# EAGLE design MA163 (EAGLE 9.6.2)

## Sheet 1 of 3
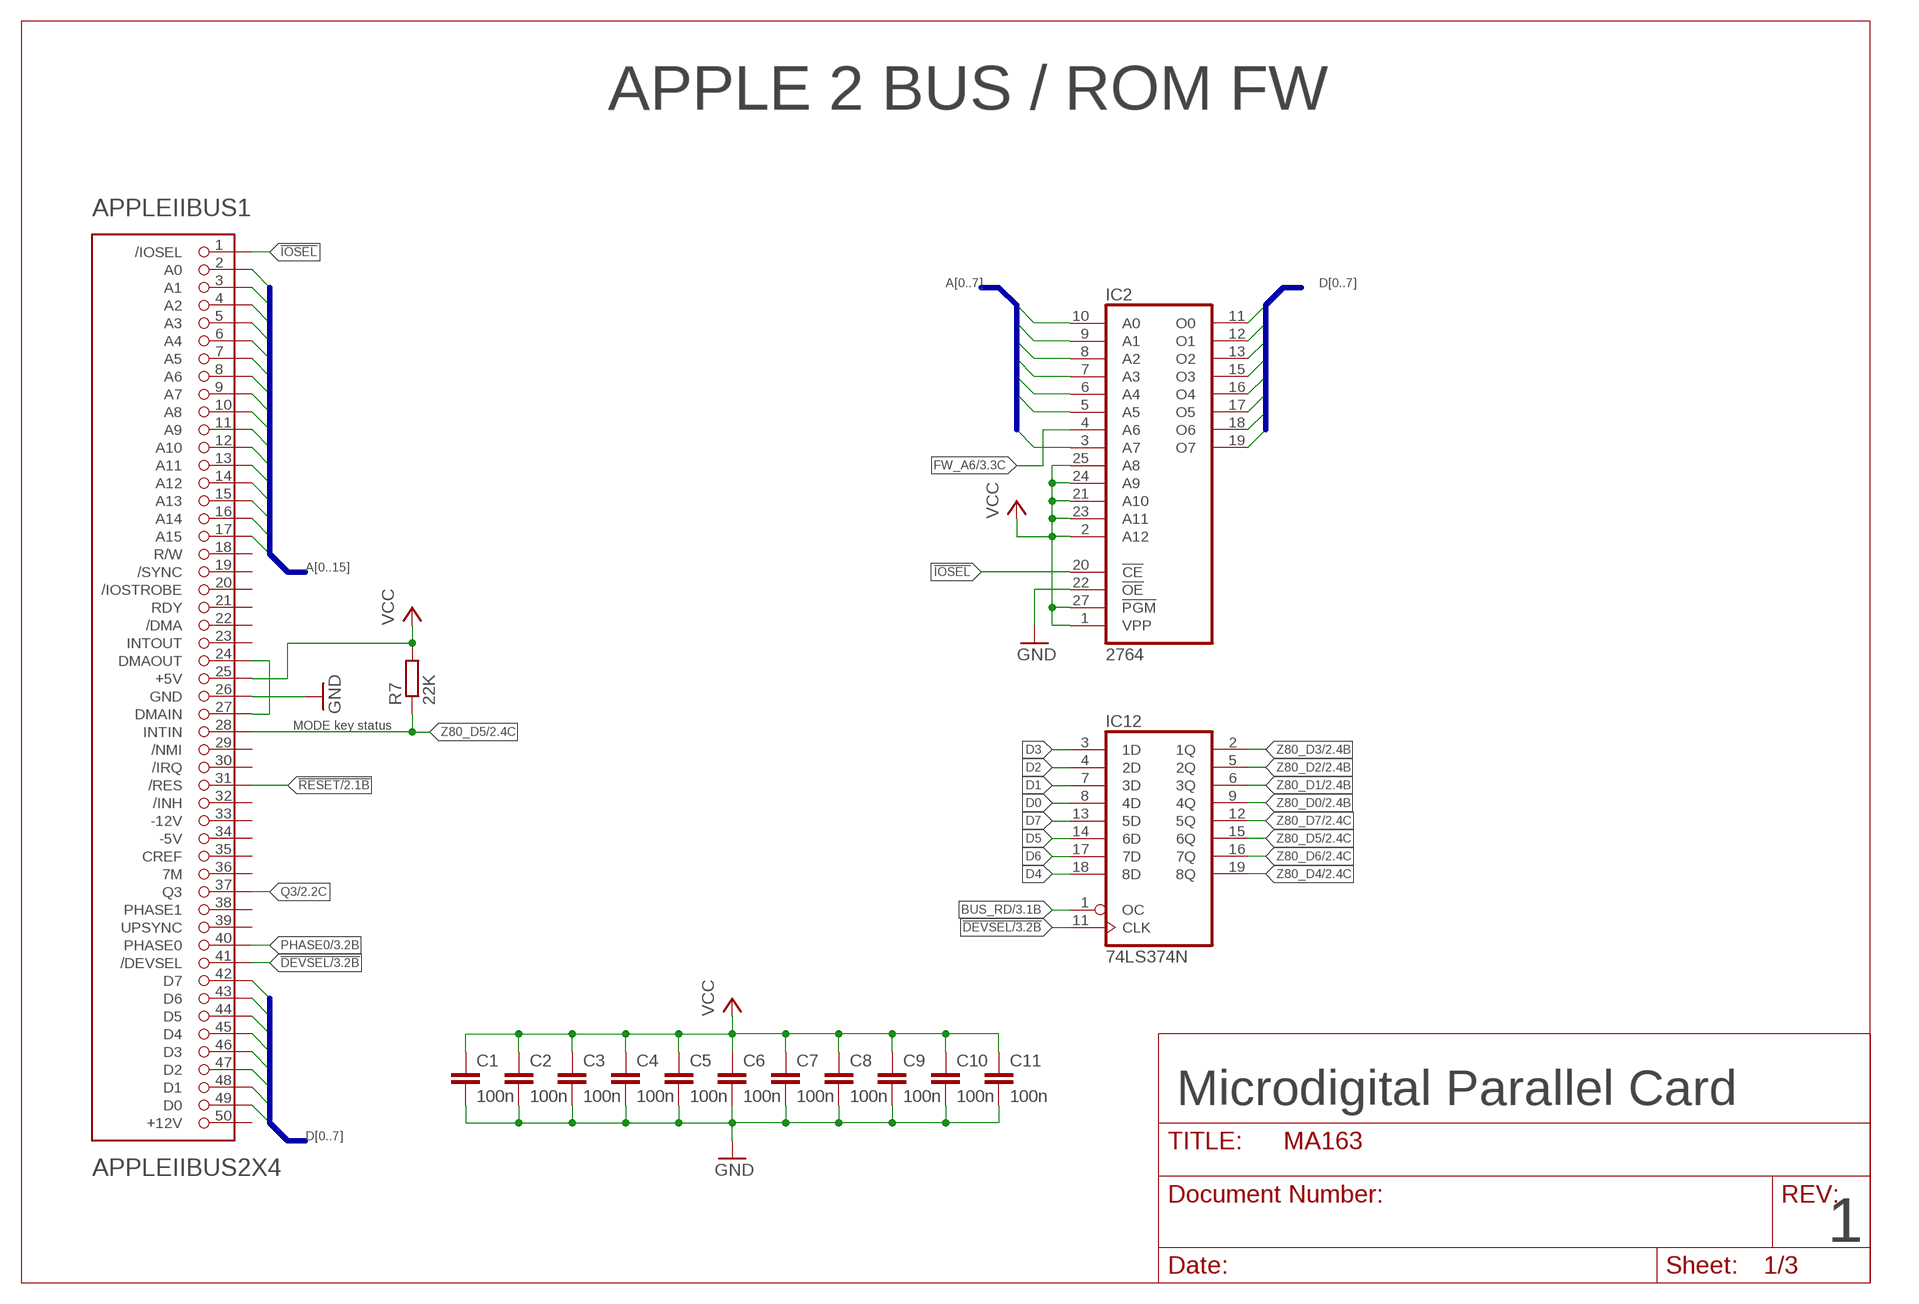
[diagram p0: schematic, sheet 1]

### Parts
APPLEIIBUS1  APPLEIIBUS2X4  [SLOT]
C1  100n  C-EU050-025X075  [C050-025X075]
C2  100n  C-EU050-025X075  [C050-025X075]
C3  100n  C-EU050-025X075  [C050-025X075]
C4  100n  C-EU050-025X075  [C050-025X075]
C5  100n  C-EU050-025X075  [C050-025X075]
C6  100n  C-EU050-025X075  [C050-025X075]
C7  100n  C-EU050-025X075  [C050-025X075]
C8  100n  C-EU050-025X075  [C050-025X075]
C9  100n  C-EU050-025X075  [C050-025X075]
C10  100n  C-EU050-025X075  [C050-025X075]
C11  100n  C-EU050-025X075  [C050-025X075]
IC2  2764  [DIL28]
IC12  74LS374N  [DIL20]
R7  22K  R-EU_0207/12  [0207/12]

### Nets
!DEVSEL: APPLEIIBUS1.41(/DEVSEL) IC12.11(CLK) ; also sheet 3
!IOSEL: APPLEIIBUS1.1(/IOSEL) IC2.20(!CE)
!RESET: APPLEIIBUS1.31(/RES) ; also sheet 2,3
A0: APPLEIIBUS1.2(A0) IC2.10(A0)
A1: APPLEIIBUS1.3(A1) IC2.9(A1)
A2: APPLEIIBUS1.4(A2) IC2.8(A2)
A3: APPLEIIBUS1.5(A3) IC2.7(A3)
A4: APPLEIIBUS1.6(A4) IC2.6(A4)
A5: APPLEIIBUS1.7(A5) IC2.5(A5)
A6: APPLEIIBUS1.8(A6) ; also sheet 3
A7: APPLEIIBUS1.9(A7) IC2.3(A7) ; also sheet 3
A8: APPLEIIBUS1.10(A8)
A9: APPLEIIBUS1.11(A9)
A10: APPLEIIBUS1.12(A10)
A11: APPLEIIBUS1.13(A11)
A12: APPLEIIBUS1.14(A12)
A13: APPLEIIBUS1.15(A13)
A14: APPLEIIBUS1.16(A14)
A15: APPLEIIBUS1.17(A15)
BUS_RD: IC12.1(OC) ; also sheet 3
D0: APPLEIIBUS1.49(D0) IC2.11(O0) IC12.8(4D)
D1: APPLEIIBUS1.48(D1) IC2.12(O1) IC12.7(3D)
D2: APPLEIIBUS1.47(D2) IC2.13(O2) IC12.4(2D)
D3: APPLEIIBUS1.46(D3) IC2.15(O3) IC12.3(1D)
D4: APPLEIIBUS1.45(D4) IC2.16(O4) IC12.18(8D)
D5: APPLEIIBUS1.44(D5) IC2.17(O5) IC12.14(6D)
D6: APPLEIIBUS1.43(D6) IC2.18(O6) IC12.17(7D)
D7: APPLEIIBUS1.42(D7) IC2.19(O7) IC12.13(5D)
FW_A6: IC2.4(A6) ; also sheet 3
GND [Power]: APPLEIIBUS1.26(GND) C1.2 C2.2 C3.2 C4.2 C5.2 C6.2 C7.2 C8.2 C9.2 C10.2 C11.2 IC2.22(!OE) ; also sheet 2,3
N$14: APPLEIIBUS1.24(DMAOUT) APPLEIIBUS1.27(DMAIN)
PHASE0: APPLEIIBUS1.40(PHASE0) ; also sheet 3
Q3: APPLEIIBUS1.37(Q3) ; also sheet 2
VCC [Power]: APPLEIIBUS1.25(+5V) C1.1 C2.1 C3.1 C4.1 C5.1 C6.1 C7.1 C8.1 C9.1 C10.1 C11.1 IC2.1(VPP) IC2.2(A12) IC2.21(A10) IC2.23(A11) IC2.24(A9) IC2.25(A8) IC2.27(!PGM) R7.2 ; also sheet 2,3
Z80_D0: IC12.9(4Q) ; also sheet 2,3
Z80_D1: IC12.6(3Q) ; also sheet 2,3
Z80_D2: IC12.5(2Q) ; also sheet 2,3
Z80_D3: IC12.2(1Q) ; also sheet 2,3
Z80_D4: IC12.19(8Q) ; also sheet 2,3
Z80_D5: APPLEIIBUS1.28(INTIN) IC12.15(6Q) R7.1 ; also sheet 2,3
Z80_D6: IC12.16(7Q) ; also sheet 2,3
Z80_D7: IC12.12(5Q) ; also sheet 2,3
Unconnected: APPLEIIBUS1.18(R/W) APPLEIIBUS1.19(/SYNC) APPLEIIBUS1.20(/IOSTROBE) APPLEIIBUS1.21(RDY) APPLEIIBUS1.22(/DMA) APPLEIIBUS1.23(INTOUT) APPLEIIBUS1.29(/NMI) APPLEIIBUS1.30(/IRQ) APPLEIIBUS1.32(/INH) APPLEIIBUS1.33(-12V) APPLEIIBUS1.34(-5V) APPLEIIBUS1.35(CREF) APPLEIIBUS1.36(7M) APPLEIIBUS1.38(PHASE1) APPLEIIBUS1.39(UPSYNC) APPLEIIBUS1.50(+12V)

### Buses
D[0..7]
A[0..15]
A[0..7]

### Notes on the sheet
- APPLE 2 BUS / ROM FW
- MODE key status
- Microdigital Parallel Card
- 1

## Sheet 2 of 3
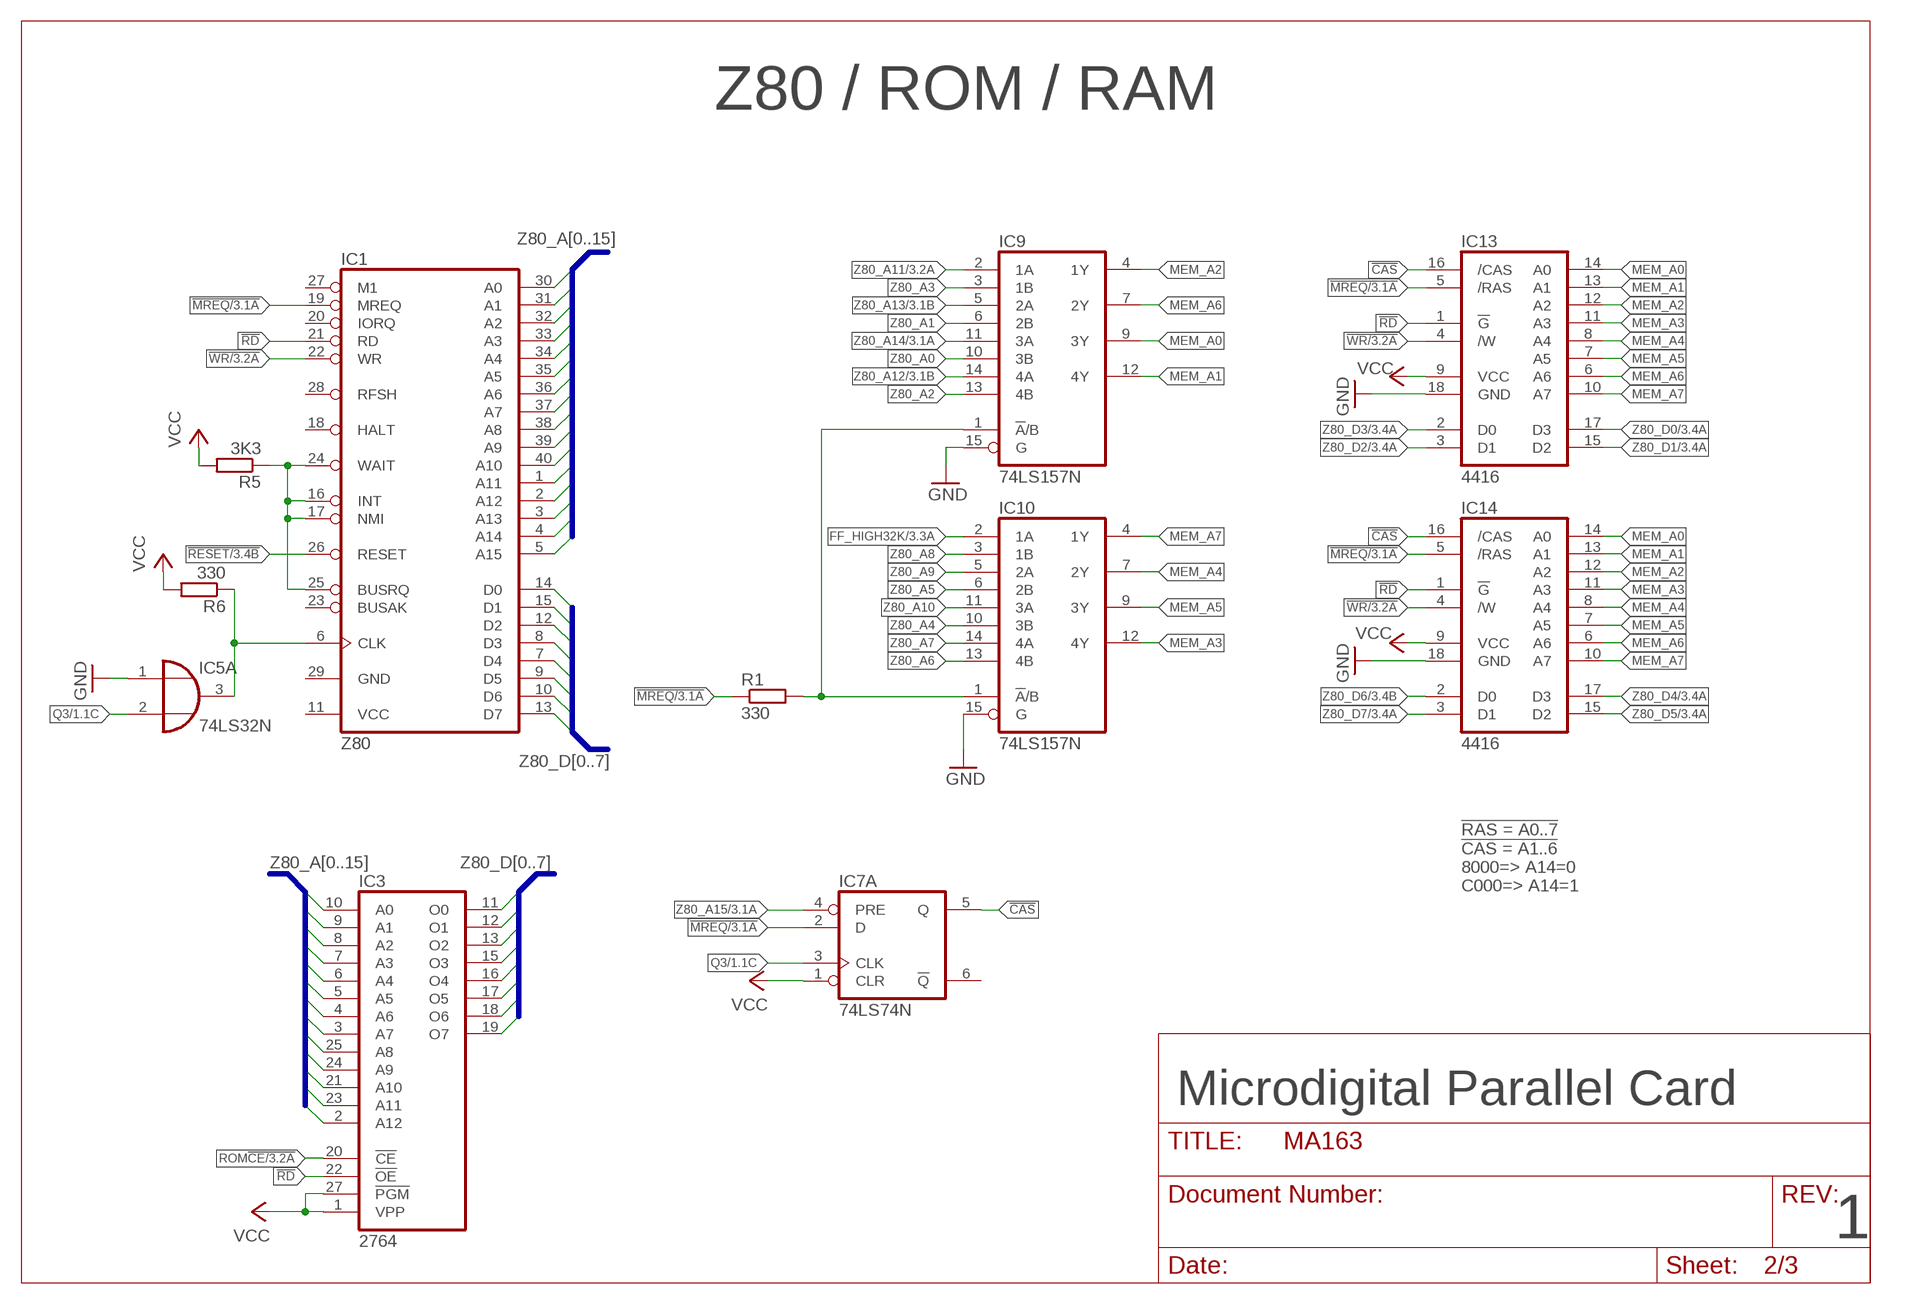
[diagram p1: schematic, sheet 2]

### Parts
IC1  Z80  Z80CPU  [DIL40]
IC3  2764  [DIL28]
IC5  74LS32N  [DIL14]
IC7  74LS74N  [DIL14]
IC9  74LS157N  [DIL16]
IC10  74LS157N  [DIL16]
IC13  4416  [DIL18]
IC14  4416  [DIL18]
R1  330  R-EU_0207/5V  [0207/5V]
R5  3K3  R-EU_0207/5V  [0207/5V]
R6  330  R-EU_0207/5V  [0207/5V]

### Nets
!CAS: IC7.5(A:Q) IC13.16(/CAS) IC14.16(/CAS)
!MREQ: IC1.19(MREQ) IC7.2(A:D) IC13.5(/RAS) IC14.5(/RAS) R1.1 ; also sheet 3
!RD: IC1.21(RD) IC3.22(!OE) IC13.1(!G) IC14.1(!G)
!RESET: IC1.26(RESET) ; also sheet 1,3
!WR: IC1.22(WR) IC13.4(/W) IC14.4(/W) ; also sheet 3
!Z80_CLK: IC1.6(CLK) IC5.3(A:O) R6.1
FF_HIGH32K: IC10.2(1A) ; also sheet 3
GND [Power]: IC5.1(A:I0) IC9.15(G) IC10.15(G) IC13.18(GND) IC14.18(GND) ; also sheet 1,3
MEM_A0: IC9.9(3Y) IC13.14(A0) IC14.14(A0)
MEM_A1: IC9.12(4Y) IC13.13(A1) IC14.13(A1)
MEM_A2: IC9.4(1Y) IC13.12(A2) IC14.12(A2)
MEM_A3: IC10.12(4Y) IC13.11(A3) IC14.11(A3)
MEM_A4: IC10.7(2Y) IC13.8(A4) IC14.8(A4)
MEM_A5: IC10.9(3Y) IC13.7(A5) IC14.7(A5)
MEM_A6: IC9.7(2Y) IC13.6(A6) IC14.6(A6)
MEM_A7: IC10.4(1Y) IC13.10(A7) IC14.10(A7)
N$1: IC1.16(INT) IC1.17(NMI) IC1.24(WAIT) IC1.25(BUSRQ) R5.1
N$4: IC9.1(!A!/B) IC10.1(!A!/B) R1.2
Q3: IC5.2(A:I1) IC7.3(A:CLK) ; also sheet 1
ROM!CE: IC3.20(!CE) ; also sheet 3
VCC [Power]: IC3.1(VPP) IC3.27(!PGM) IC7.1(A:CLR) IC13.9(VCC) IC14.9(VCC) R5.2 R6.2 ; also sheet 1,3
Z80_A0: IC1.30(A0) IC3.10(A0) IC9.10(3B)
Z80_A1: IC1.31(A1) IC3.9(A1) IC9.6(2B)
Z80_A2: IC1.32(A2) IC3.8(A2) IC9.13(4B)
Z80_A3: IC1.33(A3) IC3.7(A3) IC9.3(1B)
Z80_A4: IC1.34(A4) IC3.6(A4) IC10.10(3B)
Z80_A5: IC1.35(A5) IC3.5(A5) IC10.6(2B)
Z80_A6: IC1.36(A6) IC3.4(A6) IC10.13(4B)
Z80_A7: IC1.37(A7) IC3.3(A7) IC10.14(4A)
Z80_A8: IC1.38(A8) IC3.25(A8) IC10.3(1B)
Z80_A9: IC1.39(A9) IC3.24(A9) IC10.5(2A)
Z80_A10: IC1.40(A10) IC3.21(A10) IC10.11(3A)
Z80_A11: IC1.1(A11) IC3.23(A11) IC9.2(1A) ; also sheet 3
Z80_A12: IC1.2(A12) IC3.2(A12) IC9.14(4A) ; also sheet 3
Z80_A13: IC1.3(A13) IC9.5(2A) ; also sheet 3
Z80_A14: IC1.4(A14) IC9.11(3A) ; also sheet 3
Z80_A15: IC1.5(A15) IC7.4(A:PRE) ; also sheet 3
Z80_D0: IC1.14(D0) IC3.11(O0) IC13.17(D3) ; also sheet 1,3
Z80_D1: IC1.15(D1) IC3.12(O1) IC13.15(D2) ; also sheet 1,3
Z80_D2: IC1.12(D2) IC3.13(O2) IC13.3(D1) ; also sheet 1,3
Z80_D3: IC1.8(D3) IC3.15(O3) IC13.2(D0) ; also sheet 1,3
Z80_D4: IC1.7(D4) IC3.16(O4) IC14.17(D3) ; also sheet 1,3
Z80_D5: IC1.9(D5) IC3.17(O5) IC14.15(D2) ; also sheet 1,3
Z80_D6: IC1.10(D6) IC3.18(O6) IC14.2(D0) ; also sheet 1,3
Z80_D7: IC1.13(D7) IC3.19(O7) IC14.3(D1) ; also sheet 1,3
Unconnected: IC1.18(HALT) IC1.20(IORQ) IC1.23(BUSAK) IC1.27(M1) IC1.28(RFSH) IC7.6(A:!Q)

### Buses
Z80_D[0..7]
Z80_A[0..15]

### Notes on the sheet
- Z80 / ROM / RAM
- !RAS = A0..7
  !CAS = A1..6
  8000=> A14=0
  C000=> A14=1
- Microdigital Parallel Card
- 1

## Sheet 3 of 3
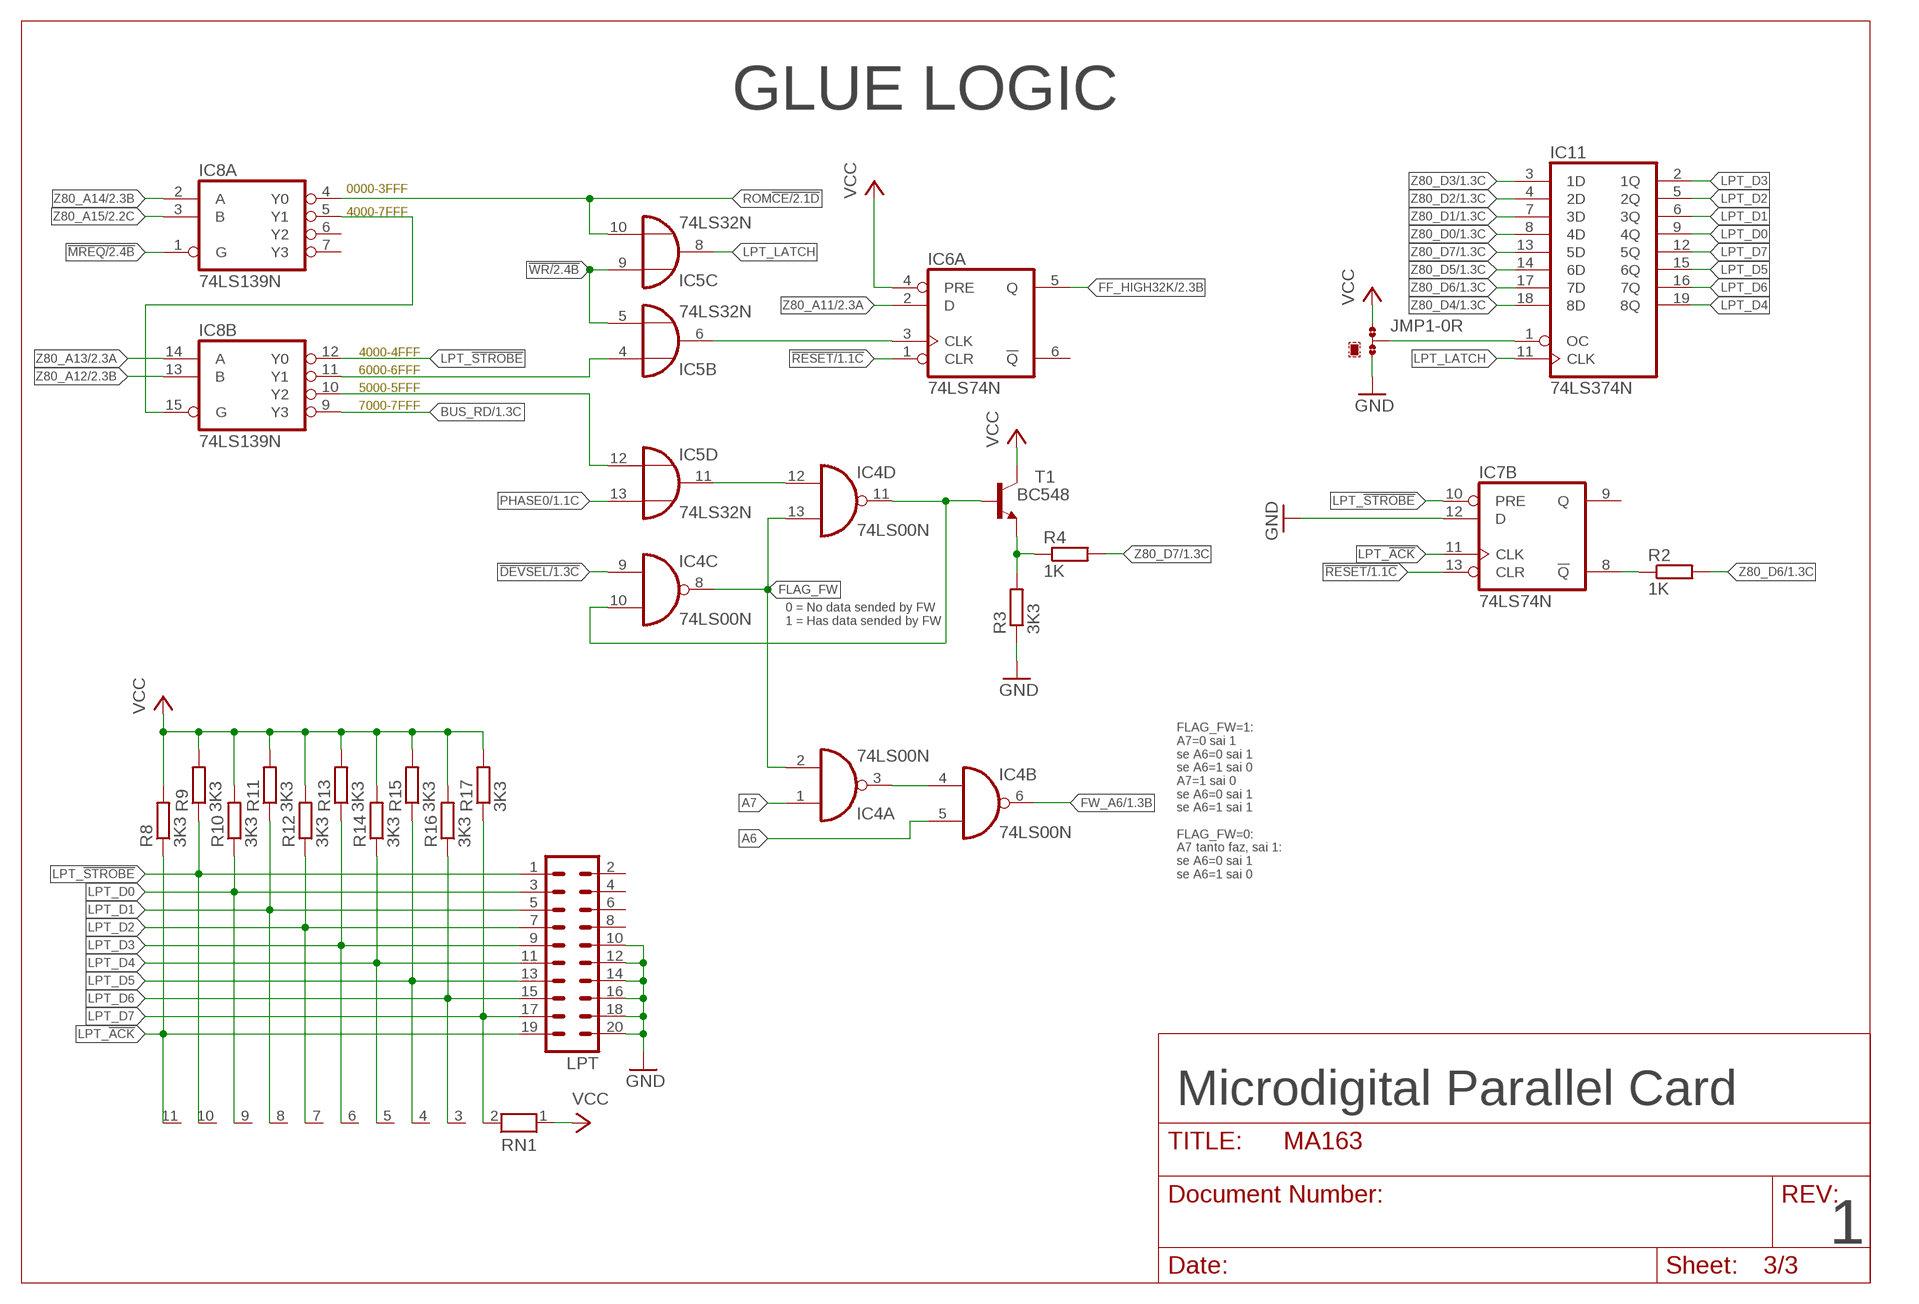
[diagram p2: schematic, sheet 3]

### Parts
IC4  74LS00N  [DIL14]
IC6  74LS74N  [DIL14]
IC8  74LS139N  [DIL16]
IC11  74LS374N  [DIL20]
JMP1  0R-JUMPB  [B0R-JMP]
LPT  MA10-2  [MA10-2]
R2  1K  R-EU_0207/5V  [0207/5V]
R3  3K3  R-EU_0207/5V  [0207/5V]
R4  1K  R-EU_0207/5V  [0207/5V]
R8  3K3  R-EU_0207/2V  [0207/2V]
R9  3K3  R-EU_0207/2V  [0207/2V]
R10  3K3  R-EU_0207/2V  [0207/2V]
R11  3K3  R-EU_0207/2V  [0207/2V]
R12  3K3  R-EU_0207/2V  [0207/2V]
R13  3K3  R-EU_0207/2V  [0207/2V]
R14  3K3  R-EU_0207/2V  [0207/2V]
R15  3K3  R-EU_0207/2V  [0207/2V]
R16  3K3  R-EU_0207/2V  [0207/2V]
R17  3K3  R-EU_0207/2V  [0207/2V]
RN1  RN10  [RN-11]
T1  BC548  -NPN-TO92L  [TO92L]

### Nets
!DEVSEL: IC4.9(C:I0) ; also sheet 1
!MREQ: IC8.1(A:G) ; also sheet 2
!RESET: IC6.1(A:CLR) IC7.13(B:CLR) ; also sheet 1,2
!WR: IC5.5(B:I1) IC5.9(C:I0) ; also sheet 2
A6: IC4.5(B:I1) ; also sheet 1
A7: IC4.1(A:I0) ; also sheet 1
BUS_RD: IC8.9(B:Y3) ; also sheet 1
FF_HIGH32K: IC6.5(A:Q) ; also sheet 2
FLAG_FW: IC4.2(A:I1) IC4.8(C:O) IC4.13(D:I1)
FW_A6: IC4.6(B:O) ; also sheet 1
GND [Power]: IC7.12(B:D) JMP1.3 LPT.10 LPT.12 LPT.14 LPT.16 LPT.18 LPT.20 R3.1 ; also sheet 1,2
LPT_!ACK: IC7.11(B:CLK) LPT.19 R8.1 RN1.11
LPT_!STROBE: IC7.10(B:PRE) IC8.12(B:Y0) LPT.1 R9.1 RN1.10
LPT_D0: IC11.9(4Q) LPT.3 R10.1 RN1.9
LPT_D1: IC11.6(3Q) LPT.5 R11.1 RN1.8
LPT_D2: IC11.5(2Q) LPT.7 R12.1 RN1.7
LPT_D3: IC11.2(1Q) LPT.9 R13.1 RN1.6
LPT_D4: IC11.19(8Q) LPT.11 R14.1 RN1.5
LPT_D5: IC11.15(6Q) LPT.13 R15.1 RN1.4
LPT_D6: IC11.16(7Q) LPT.15 R16.1 RN1.3
LPT_D7: IC11.12(5Q) LPT.17 R17.1 RN1.2
LPT_LATCH: IC5.8(C:O) IC11.11(CLK)
N$2: IC7.8(B:!Q) R2.1
N$3: R3.2 R4.1 T1.1(E)
N$5: IC5.4(B:I0) IC8.11(B:Y1)
N$6: IC4.3(A:O) IC4.4(B:I0)
N$8: IC8.5(A:Y1) IC8.15(B:G)
N$10: IC11.1(OC) JMP1.2
N$11: IC4.10(C:I1) IC4.11(D:O) T1.2(B)
N$15: IC4.12(D:I0) IC5.11(D:O)
N$18: IC5.6(B:O) IC6.3(A:CLK)
N$19: IC5.12(D:I0) IC8.10(B:Y2)
PHASE0: IC5.13(D:I1) ; also sheet 1
ROM!CE: IC5.10(C:I1) IC8.4(A:Y0) ; also sheet 2
VCC [Power]: IC6.4(A:PRE) JMP1.1 R8.2 R9.2 R10.2 R11.2 R12.2 R13.2 R14.2 R15.2 R16.2 R17.2 RN1.1 T1.3(C) ; also sheet 1,2
Z80_A11: IC6.2(A:D) ; also sheet 2
Z80_A12: IC8.13(B:B) ; also sheet 2
Z80_A13: IC8.14(B:A) ; also sheet 2
Z80_A14: IC8.2(A:A) ; also sheet 2
Z80_A15: IC8.3(A:B) ; also sheet 2
Z80_D0: IC11.8(4D) ; also sheet 1,2
Z80_D1: IC11.7(3D) ; also sheet 1,2
Z80_D2: IC11.4(2D) ; also sheet 1,2
Z80_D3: IC11.3(1D) ; also sheet 1,2
Z80_D4: IC11.18(8D) ; also sheet 1,2
Z80_D5: IC11.14(6D) ; also sheet 1,2
Z80_D6: IC11.17(7D) R2.2 ; also sheet 1,2
Z80_D7: IC11.13(5D) R4.2 ; also sheet 1,2
Unconnected: IC6.6(A:!Q) IC6.8(B:!Q) IC6.9(B:Q) IC6.10(B:PRE) IC6.11(B:CLK) IC6.12(B:D) IC6.13(B:CLR) IC7.9(B:Q) IC8.6(A:Y2) IC8.7(A:Y3) LPT.2 LPT.4 LPT.6 LPT.8

### Notes on the sheet
- GLUE LOGIC
- 0000-3FFF
- 4000-7FFF
- 4000-4FFF
- 6000-6FFF
- 5000-5FFF
- 7000-7FFF
- 0 = No data sended by FW
  1 = Has data sended by FW
- FLAG_FW=1:
  A7=0 sai 1
  se A6=0 sai 1
  se A6=1 sai 0
  A7=1 sai 0
  se A6=0 sai 1
  se A6=1 sai 1
  
  FLAG_FW=0:
  A7 tanto faz, sai 1:
  se A6=0 sai 1
  se A6=1 sai 0
- Microdigital Parallel Card
- 1

## Power pins joined to a net without a drawn wire
GND: IC1.29(GND) IC2.14(GND) IC3.14(GND) IC4.7(P:GND) IC5.7(P:GND) IC6.7(P:GND) IC7.7(P:GND) IC8.8(P:GND) IC9.8(GND) IC10.8(GND) IC11.10(GND) IC12.10(GND)
VCC: IC1.11(VCC) IC2.28(VCC) IC3.28(VCC) IC4.14(P:VCC) IC5.14(P:VCC) IC6.14(P:VCC) IC7.14(P:VCC) IC8.16(P:VCC) IC9.16(VCC) IC10.16(VCC) IC11.20(VCC) IC12.20(VCC)

## Library data of the parts
APPLEIIBUS1 = AppleII:APPLEIIBUS: BUS do Apple II
C1-C11 = rcl:C-EU: CAPACITOR, European symbol
IC1 = zilog:Z80CPU: Z80 FAMILY DEVICE
IC2 IC3 = memory:2764: MEMORY
IC4 = 74xx-eu:74*00: Quad 2-input NAND gate
IC5 = 74xx-eu:74*32: Quad 2-input OR gate
IC6 IC7 = 74xx-eu:74*74: Dual D type positive edge triggered FLIP FLOP, preset and clear
IC8 = 74xx-eu:74*139: Dual 2-line to 4-line DECODER/DEMULTIPLEXER
IC9 IC10 = 74xx-eu:74*157: Quadruple 2-line to 1-line data SELECTOR/MULTIPLEXER
IC11 IC12 = 74xx-eu:74*374: Octal D type transparent LATCH, edge triggered
IC13 IC14 = DRAM:4416: 16K DRAM
JMP1 = jump-0r-smd:0R-JUMP: SMD 0R 0805 Jumper
LPT = con-lstb:MA10-2: PIN HEADER; OC_FARNELL: unknown; OC_NEWARK: unknown
R1-R17 = rcl:R-EU_: RESISTOR, European symbol
RN1 = resistor-net:RN10: RESISTOR NETWORK; OC_FARNELL: unknown; OC_NEWARK: unknown
T1 = transistor:*-NPN-: NPN Transistror BF959 corrected 2008.03.06

## Net classes
0 default: width 0.203 mm, drill 0.55 mm, clearance 0.203 mm
1 Power: width 0.813 mm, drill 0.8 mm, clearance 0.203 mm

## Board
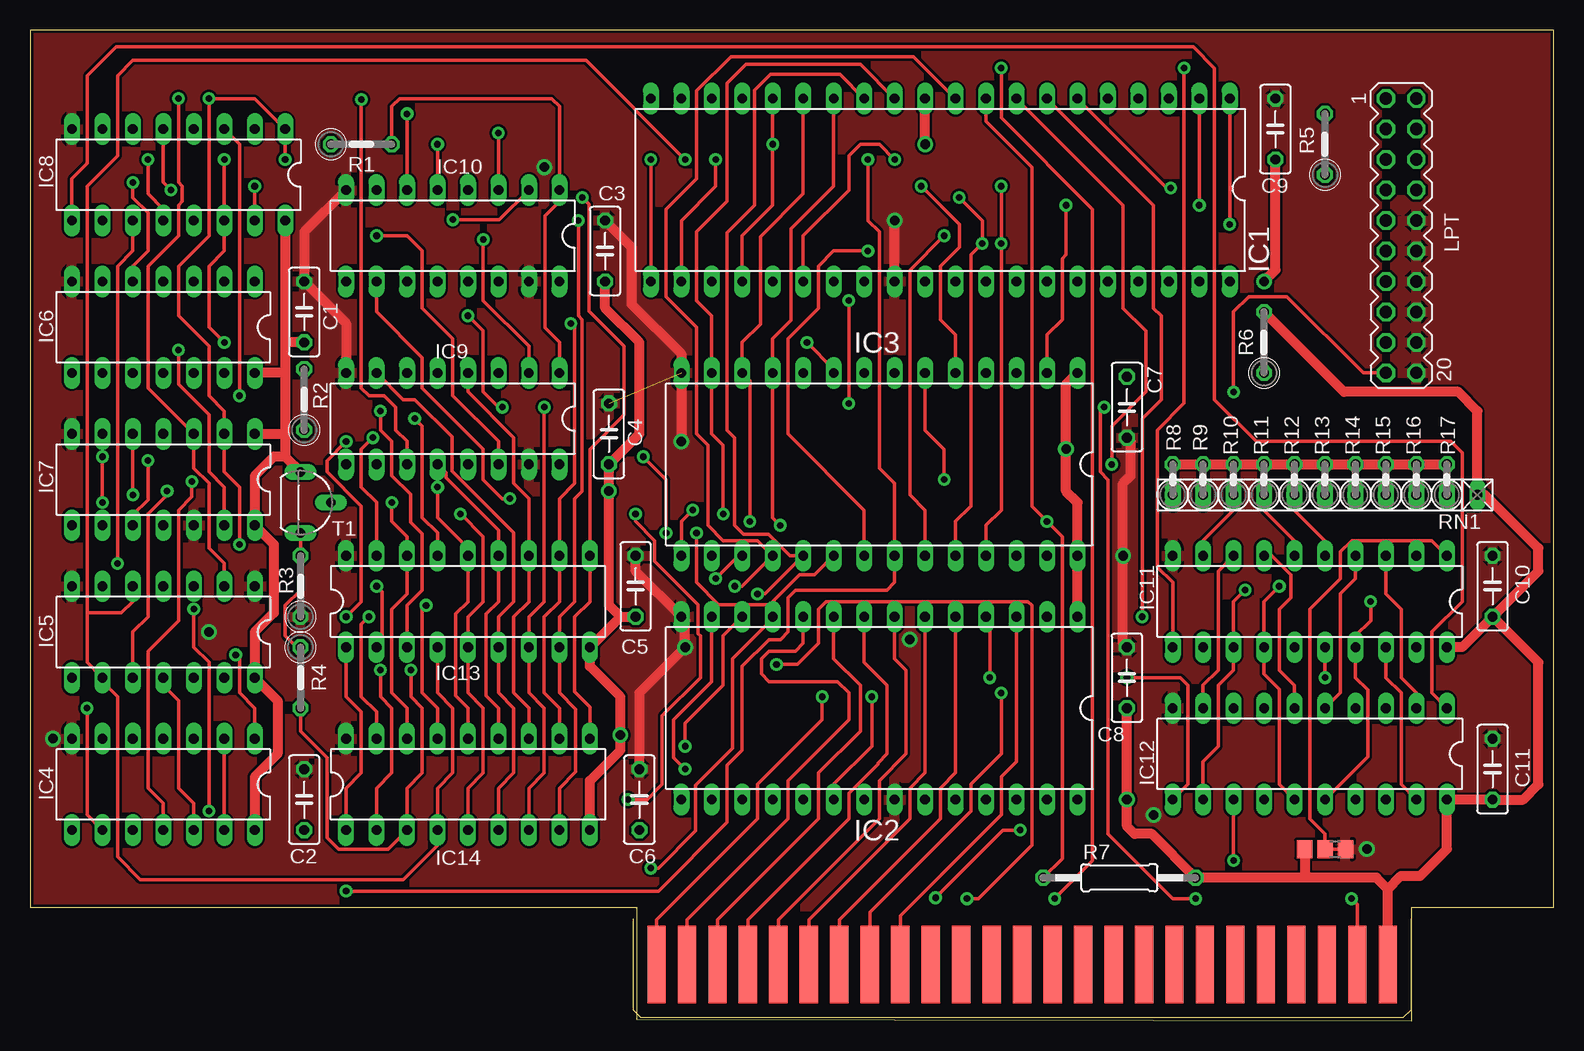
[diagram p3: board, top side]
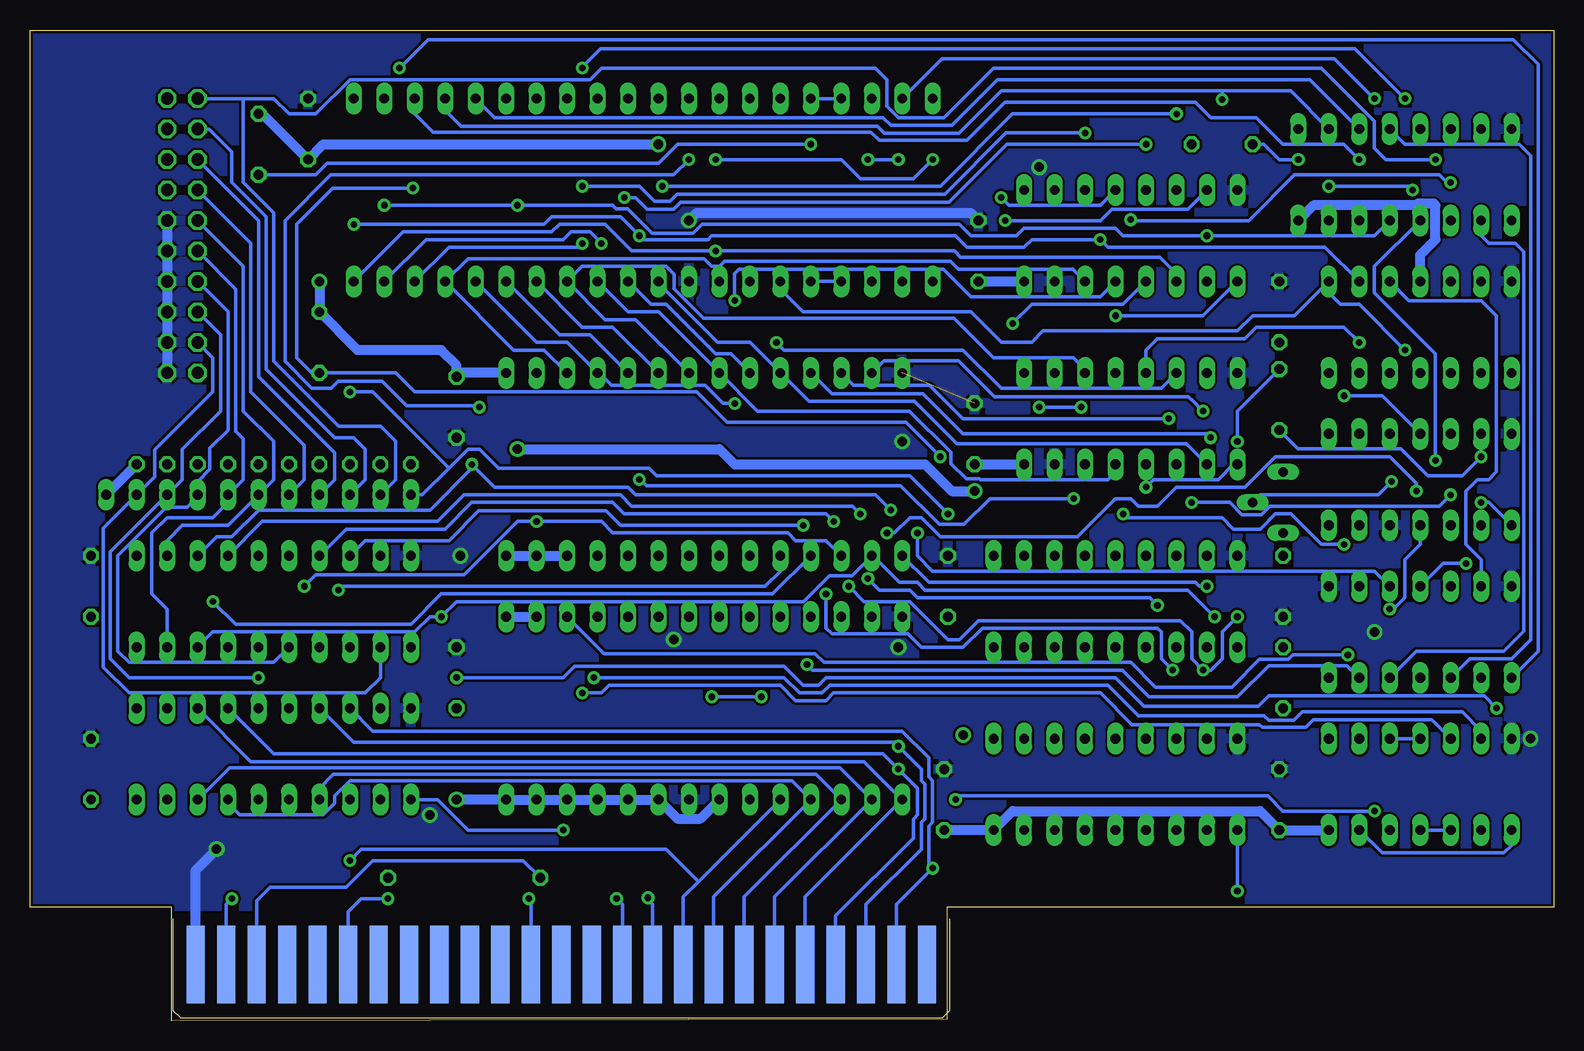
[diagram p4: board, bottom side, seen from below]

Size 127 x 82.55 mm. Coordinates in mm from the lower left corner, seen from the top.
Outline: 0,9.46 50.55,9.46 50.55,0.13 115.19,0 115.19,9.46 127,9.46 127,82.55 0,82.55 0,9.46
Copper layers (1*16): Top 0.035mm / dielectric 1.5mm / Bottom 0.035mm
Design rules "SparkFun(8mil) *": minimum track width 10mil, minimum drill 20mil, track to track 8mil, track to pad 8mil, pad to pad 8mil, via to via 8mil, smd to smd 8mil, copper to edge 10mil, drill to drill 8mil, minimum pad ring 10mil, minimum via ring 10mil, stop-mask expansion 4mil, vias tented up to drill 25mil, thermal gap 10mil

### Footprints (pad centres in the part's own frame; a part is rotated, then mirrored left to right if it is on the bottom)
SLOT = smd 1.524 x 6.477: 1 -45.72,-2.54; 2 -43.18,-2.54; 3 -40.64,-2.54; 4 -38.1,-2.54; 5 -35.56,-2.54; 6 -33.02,-2.54; 7 -30.48,-2.54; 8 -27.94,-2.54; 9 -25.4,-2.54; 10 -22.86,-2.54; 11 -20.32,-2.54; 12 -17.78,-2.54; 13 -15.24,-2.54; 14 -12.7,-2.54; 15 -10.16,-2.54; 16 -7.62,-2.54; 17 -5.08,-2.54; 18 -2.54,-2.54; 19 0,-2.54; 20 2.54,-2.54; 21 5.08,-2.54; 22 7.62,-2.54; 23 10.16,-2.54; 24 12.7,-2.54; 25 15.24,-2.54 | smd 1.524 x 6.477 bottom: 26 15.24,-2.54; 27 12.7,-2.54; 28 10.16,-2.54; 29 7.62,-2.54; 30 5.08,-2.54; 31 2.54,-2.54; 32 0,-2.54; 33 -2.54,-2.54; 34 -5.08,-2.54; 35 -7.62,-2.54; 36 -10.16,-2.54; 37 -12.7,-2.54; 38 -15.24,-2.54; 39 -17.78,-2.54; 40 -20.32,-2.54; 41 -22.86,-2.54; 42 -25.4,-2.54; 43 -27.94,-2.54; 44 -30.48,-2.54; 45 -33.02,-2.54; 46 -35.56,-2.54; 47 -38.1,-2.54; 48 -40.64,-2.54; 49 -43.18,-2.54; 50 -45.72,-2.54
C050-025X075 = drill 0.813 octagon: 1 -2.54,0; 2 2.54,0
DIL40 = drill 0.813 long: 1 -24.13,-7.62; 2 -21.59,-7.62; 3 -19.05,-7.62; 4 -16.51,-7.62; 5 -13.97,-7.62; 6 -11.43,-7.62; 7 -8.89,-7.62; 8 -6.35,-7.62; 9 -3.81,-7.62; 10 -1.27,-7.62; 11 1.27,-7.62; 12 3.81,-7.62; 13 6.35,-7.62; 14 8.89,-7.62; 15 11.43,-7.62; 16 13.97,-7.62; 17 16.51,-7.62; 18 19.05,-7.62; 19 21.59,-7.62; 20 24.13,-7.62; 21 24.13,7.62; 22 21.59,7.62; 23 19.05,7.62; 24 16.51,7.62; 25 13.97,7.62; 26 11.43,7.62; 27 8.89,7.62; 28 6.35,7.62; 29 3.81,7.62; 30 1.27,7.62; 31 -1.27,7.62; 32 -3.81,7.62; 33 -6.35,7.62; 34 -8.89,7.62; 35 -11.43,7.62; 36 -13.97,7.62; 37 -16.51,7.62; 38 -19.05,7.62; 39 -21.59,7.62; 40 -24.13,7.62
DIL28 = drill 0.813 long: 1 -16.51,-7.62; 2 -13.97,-7.62; 3 -11.43,-7.62; 4 -8.89,-7.62; 5 -6.35,-7.62; 6 -3.81,-7.62; 7 -1.27,-7.62; 8 1.27,-7.62; 9 3.81,-7.62; 10 6.35,-7.62; 11 8.89,-7.62; 12 11.43,-7.62; 13 13.97,-7.62; 14 16.51,-7.62; 15 16.51,7.62; 16 13.97,7.62; 17 11.43,7.62; 18 8.89,7.62; 19 6.35,7.62; 20 3.81,7.62; 21 1.27,7.62; 22 -1.27,7.62; 23 -3.81,7.62; 24 -6.35,7.62; 25 -8.89,7.62; 26 -11.43,7.62; 27 -13.97,7.62; 28 -16.51,7.62
DIL14 = drill 0.813 long: 1 -7.62,-3.81; 2 -5.08,-3.81; 3 -2.54,-3.81; 4 0,-3.81; 5 2.54,-3.81; 6 5.08,-3.81; 7 7.62,-3.81; 8 7.62,3.81; 9 5.08,3.81; 10 2.54,3.81; 11 0,3.81; 12 -2.54,3.81; 13 -5.08,3.81; 14 -7.62,3.81
DIL16 = drill 0.813 long: 1 -8.89,-3.81; 2 -6.35,-3.81; 3 -3.81,-3.81; 4 -1.27,-3.81; 5 1.27,-3.81; 6 3.81,-3.81; 7 6.35,-3.81; 8 8.89,-3.81; 9 8.89,3.81; 10 6.35,3.81; 11 3.81,3.81; 12 1.27,3.81; 13 -1.27,3.81; 14 -3.81,3.81; 15 -6.35,3.81; 16 -8.89,3.81
DIL20 = drill 0.813 long: 1 -11.43,-3.81; 2 -8.89,-3.81; 3 -6.35,-3.81; 4 -3.81,-3.81; 5 -1.27,-3.81; 6 1.27,-3.81; 7 3.81,-3.81; 8 6.35,-3.81; 9 8.89,-3.81; 10 11.43,-3.81; 11 11.43,3.81; 12 8.89,3.81; 13 6.35,3.81; 14 3.81,3.81; 15 1.27,3.81; 16 -1.27,3.81; 17 -3.81,3.81; 18 -6.35,3.81; 19 -8.89,3.81; 20 -11.43,3.81
DIL18 = drill 0.813 long: 1 -10.16,-3.81; 2 -7.62,-3.81; 3 -5.08,-3.81; 4 -2.54,-3.81; 5 0,-3.81; 6 2.54,-3.81; 7 5.08,-3.81; 8 7.62,-3.81; 9 10.16,-3.81; 10 10.16,3.81; 11 7.62,3.81; 12 5.08,3.81; 13 2.54,3.81; 14 0,3.81; 15 -2.54,3.81; 16 -5.08,3.81; 17 -7.62,3.81; 18 -10.16,3.81
B0R-JMP = smd 1.5 x 1.3: 1 0,1.7; 2 0,0; 3 0,-1.7
MA10-2 = drill 1.016 octagon: 1 -11.43,-1.27; 2 -11.43,1.27; 3 -8.89,-1.27; 4 -8.89,1.27; 5 -6.35,-1.27; 6 -6.35,1.27; 7 -3.81,-1.27; 8 -3.81,1.27; 9 -1.27,-1.27; 10 -1.27,1.27; 11 1.27,-1.27; 12 1.27,1.27; 13 3.81,-1.27; 14 3.81,1.27; 15 6.35,-1.27; 16 6.35,1.27; 17 8.89,-1.27; 18 8.89,1.27; 19 11.43,-1.27; 20 11.43,1.27
0207/5V = drill 0.813 octagon: 1 -2.54,0; 2 2.54,0
0207/12 = drill 0.813 octagon: 1 -6.35,0; 2 6.35,0
0207/2V = drill 0.813 octagon: 1 -1.27,0; 2 1.27,0
RN-11 = drill 0.813 long: 1 -12.7,0; 2 -10.16,0; 3 -7.62,0; 4 -5.08,0; 5 -2.54,0; 6 0,0; 7 2.54,0; 8 5.08,0; 9 7.62,0; 10 10.16,0; 11 12.7,0
TO92L = drill 0.813 long: 1 0,-2.54; 2 2.54,0; 3 0,2.54

### Placement (x,y rotation side)
APPLEIIBUS1  97.94,7.21 0 top
C1  22.86,59.05 90 top
C2  22.86,18.41 90 top
C3  47.94,64.14 90 top
C4  48.26,48.9 90 top
C5  50.48,36.2 90 top
C6  50.8,18.41 90 top
C7  91.44,51.12 270 top
C8  91.44,28.57 90 top
C9  103.82,74.3 90 top
C10  121.92,36.2 90 top
C11  121.92,20.95 90 top
IC1  75.88,69.22 180 top
IC2  70.8,26.04 180 top
IC3  70.8,46.35 180 top
IC4  11.11,19.68 180 top
IC5  11.11,32.38 180 top
IC6  11.11,57.78 180 top
IC7  11.11,45.09 180 top
IC8  12.38,70.48 180 top
IC9  35.24,50.16 180 top
IC10  35.24,65.41 180 top
IC11  106.68,34.92 180 top
IC12  106.68,22.23 180 top
IC13  36.51,34.92 0 top
IC14  36.51,19.68 0 top
JMP1  107.95,14.29 90 top
LPT  114.3,65.41 270 top
R1  27.62,73.03 0 top
R2  22.86,51.75 90 top
R3  22.54,36.2 90 top
R4  22.54,28.57 270 top
R5  107.95,73.03 90 top
R6  102.87,56.52 90 top
R7  90.81,11.91 0 top
R8  95.25,45.09 90 top
R9  97.79,45.09 90 top
R10  100.33,45.09 90 top
R11  102.87,45.09 90 top
R12  105.41,45.09 90 top
R13  107.95,45.09 90 top
R14  110.49,45.09 90 top
R15  113.03,45.09 90 top
R16  115.57,45.09 90 top
R17  118.11,45.09 90 top
RN1  107.95,43.81 180 top
T1  22.54,43.18 0 top

### Tracks (layer width: path | path; a pad name or v marks a point on that pad's centre or on a via)
!CAS  (via drill 0.55)
  Top 0.305: IC14.16 31.43,26.04 30.16,27.3 30.16,34.29 31.43,35.56 IC13.16 31.43,40.32 30.16,41.59 v30.16,43.18 | IC7.5 v8.57,43.81
  Bottom 0.305: v8.57,43.81 9.53,42.86 23.65,42.86 24.34,42.16 25.97,42.16 26.99,43.18 v30.16,43.18
!DEVSEL  (via drill 0.55)
  Top 0.305: IC4.9 4.76,17.14 v4.76,26.04 | v91.44,28.57 95.89,28.57 96.52,27.94 96.52,19.68 IC12.11 | v82.55,15.88 81.12,15.88 v75.48,10.24
  Bottom 0.305: APPLEIIBUS1.41 75.08,9.68 75.56,10.16 v75.48,10.24 | v4.76,26.04 5.78,27.05 23.75,27.05 24.61,26.19 34.13,26.19 36.51,28.57 60.64,28.57 61.28,27.94 62.55,27.94 64.14,29.53 81.6,29.53 82.55,28.57 v91.44,28.57 | IC12.11 93.03,18.41 90.49,15.88 v82.55,15.88
!IOSEL  (via drill 0.55)
  Top 0.305: APPLEIIBUS1.1 52.22,8.41 60.64,16.83 60.64,19.68 66.04,25.08 v66.04,26.99 | IC2.20 66.99,19.68 70.17,22.86 v70.17,26.99
  Bottom 0.305: v66.04,26.99 v70.17,26.99
!MREQ  (via drill 0.55)
  Top 0.305: IC14.5 36.51,19.37 37.78,20.64 37.78,26.04 36.51,27.3 IC13.5 36.51,33.66 37.78,34.92 37.78,40.32 v35.88,42.23 | v17.46,39.69 17.46,44.45 16.19,45.72 IC7.2 16.19,50.8 14.92,52.07 14.92,56.2 12.38,58.74 12.38,62.87 14.92,65.41 v14.92,76.83 18.73,76.83 IC8.1 v21.27,71.75
  Bottom 0.305: v35.88,42.23 35.56,41.91 27.62,41.91 26.67,40.96 24.45,40.96 23.18,42.23 21.91,42.23 19.37,39.69 v17.46,39.69 | v14.92,76.83 18.26,80.17 50.96,80.17 IC1.19 | v21.27,71.75 22.86,71.75 24.13,73.03 R1.1
!RD  (via drill 0.55)
  Top 0.305: IC14.1 26.35,19.37 27.62,20.64 27.62,25.72 26.35,26.99 IC13.1 | v26.35,10.79 52.39,10.79 58.1,16.51 58.1,21.27 59.37,22.54 59.37,29.53 61.59,31.75 62.55,31.75 63.18,32.38 63.18,35.24 63.82,35.88 71.44,35.88 72.07,36.51 IC3.22 72.07,44.77 70.8,46.04 70.8,65.72 69.85,66.67 v69.85,71.75 | IC1.21 v51.75,71.75
  Bottom 0.305: IC14.1 v26.35,10.79 | v51.75,71.75 53.34,70.17 57.78,70.17 59.37,71.75 v69.85,71.75
!RESET  (via drill 0.55)
  Top 0.305: v97.16,10.16 95.25,10.16 89.85,15.56 89.85,45.09 89.22,45.72 89.22,50.8 v89.53,51.12 | v72.07,71.75 70.8,73.03 69.22,73.03 68.26,72.07 68.26,69.22 64.45,65.41 IC1.26 | v12.38,55.88 12.38,53.02 14.92,50.48 14.92,45.72 16.19,44.45 IC7.13
  Bottom 0.305: APPLEIIBUS1.31 100.48,9.05 99.38,10.16 v97.16,10.16 | v89.53,51.12 89.66,51.24 95.61,51.24 97.64,53.27 101.33,53.27 101.9,52.7 103.5,52.7 105.73,54.93 105.73,66.67 101.92,70.48 73.34,70.48 v72.07,71.75 | IC1.26 64.45,60.96 62.55,59.05 48.58,59.05 46.04,56.52 43.5,56.52 42.55,57.47 26.35,57.47 25.08,58.74 21.59,58.74 IC6.1 18.73,60.64 17.78,59.69 16.19,59.69 v12.38,55.88
!WR  (via drill 0.55)
  Top 0.305: IC13.4 33.97,27.3 35.24,26.04 35.24,20.64 33.97,19.37 IC14.4 33.97,14.61 31.11,11.75 9.21,11.75 7.3,13.65 7.3,26.99 6.03,28.26 IC5.9 4.76,29.84 4.76,33.97 | 4.76,33.97 7.62,33.97 8.57,34.92 IC5.5 | 4.76,33.97 4.76,69.53 7.3,72.07 7.3,78.74 8.57,80.01 46.35,80.01 v54.61,71.75 | v57.15,71.75 57.15,69.53 54.29,66.67 IC1.22
  Bottom 0.305: v54.61,71.75 v57.15,71.75
!Z80_CLK  (via drill 0.55)
  Top 0.305: IC1.6 94.93,69.22 v95.09,69.37 | v51.12,46.99 53.02,45.09 v53.02,40.64
  Bottom 0.305: v95.09,69.37 101.76,69.37 104.78,66.36 104.78,55.24 103.5,53.98 R6.1 96.52,53.98 94.93,52.39 71.44,52.39 68.9,49.85 53.98,49.85 v51.12,46.99 | v53.02,40.64 53.02,38.73 51.75,37.47 14.92,37.47 IC5.3
A0
  Top 0.305: APPLEIIBUS1.2 54.76,8.41 63.18,16.83 63.18,20 68.26,25.08 68.26,27.3 67.31,28.26 61.59,28.26 60.96,28.89 60.96,30.16 61.59,30.8 63.82,30.8 64.45,31.43 IC2.10
A1
  Top 0.305: APPLEIIBUS1.3 57.3,8.41 65.72,16.83 65.72,20.64 69.22,24.13 69.22,27.94 66.99,30.16 IC2.9
A2
  Top 0.305: APPLEIIBUS1.4 59.84,8.41 68.26,16.83 68.26,18.97 70.67,21.38 70.67,21.46 71.44,22.23 71.44,27.94 69.53,29.84 IC2.8
A3
  Top 0.305: APPLEIIBUS1.5 62.38,8.41 70.8,16.83 70.8,20 73.03,22.23 73.03,29.21 72.07,30.16 IC2.7
A4
  Top 0.305: APPLEIIBUS1.6 64.92,8.41 73.34,16.83 73.34,19.37 74.61,20.64 IC2.6
A5
  Top 0.305: APPLEIIBUS1.7 67.46,8.41 75.88,16.83 75.88,19.37 77.15,20.64 IC2.5
A6  (via drill 0.55)
  Top 0.305: APPLEIIBUS1.8 70,9.04 78.42,17.46 78.42,19.68 80.96,22.23 v80.96,27.3
  Bottom 0.305: IC4.5 10.16,25.08 20,25.08 20.64,24.45 24.28,24.45 24.5,24.67 35.15,24.67 37.78,27.3 60.01,27.3 60.64,26.67 63.18,26.67 64.45,27.94 78.74,27.94 79.38,27.3 v80.96,27.3
A7  (via drill 0.55)
  Top 0.305: APPLEIIBUS1.9 72.54,8.73 80.96,17.14 80.96,20.32 82.23,21.59 IC2.3 | IC4.1 18.73,26.04 17.46,27.3 17.46,30.16 v17.14,30.48
  Bottom 0.305: v17.14,30.48 21.74,30.48 22.12,30.1 24.51,30.1 26.83,27.78 33.18,27.78 35.24,29.84 60.82,29.84 61.55,30.57 79.15,30.57 IC2.3
BUS_RD
  Top 0.305: IC12.1 116.84,27.3 116.84,32.38 119.38,34.92 119.38,47.31 118.43,48.26 102.23,48.26 98.74,51.75 98.74,79.38 96.97,81.15 7.18,81.15 4.76,78.74 4.76,71.44 3.49,70.17 IC8.9
D0  (via drill 0.55)
  Top 0.305: IC2.11 61.91,33.5 58.58,30.16 58.58,22.7 55.49,19.62 55.49,15.81 52.39,12.7 v51.75,12.7
  Bottom 0.305: APPLEIIBUS1.49 54.76,9.69 v51.75,12.7 52.07,13.02 52.07,16.19 51.75,16.51 51.75,20 52.07,20.32 52.07,21.91 54.29,24.13 98.42,24.13 IC12.8
D1  (via drill 0.55)
  Top 0.305: IC2.12 57.78,32.07 57.78,27.94 54.61,24.77 v54.61,22.86
  Bottom 0.305: APPLEIIBUS1.48 57.3,9.69 52.7,14.29 52.7,16.51 52.39,16.83 52.39,19.68 52.7,20 52.7,20.95 v54.61,22.86 54.93,23.18 100.01,23.18 IC12.7
D2  (via drill 0.55)
  Top 0.305: IC2.13 56.83,28.26 53.66,25.08 53.66,21.91 v54.61,20.95
  Bottom 0.305: APPLEIIBUS1.47 59.84,8.74 53.37,15.21 53.37,16.8 53.02,17.14 53.02,19.37 v54.61,20.95 55.88,22.23 106.68,22.23 IC12.4
D3
  Bottom 0.305: IC12.3 108.58,21.59 57.47,21.59 IC2.15 62.38,10.32 APPLEIIBUS1.46
D4
  Bottom 0.305: IC12.18 110.36,21.08 59.5,21.08 IC2.16 64.92,10.32 APPLEIIBUS1.45
D5
  Bottom 0.305: IC12.14 102.87,19.37 101.73,20.51 61.47,20.51 IC2.17 67.46,10.32 APPLEIIBUS1.44
D6
  Bottom 0.305: IC12.17 110.49,18.1 109.54,17.14 102.55,17.14 101.6,18.1 101.6,18.73 100.33,20 63.5,20 IC2.18 70,10.32 APPLEIIBUS1.43
D7  (via drill 0.55)
  Top 0.305: IC12.13 v100.33,13.34
  Bottom 0.305: v100.33,13.34 99.38,14.29 73.98,14.29 71.28,11.59 | APPLEIIBUS1.42 72.54,10.32 71.28,11.59 | 71.28,11.59 IC2.19
FF_HIGH32K  (via drill 0.55)
  Top 0.305: IC6.5 8.57,62.87 9.84,64.14 9.84,67.31 8.57,68.58 v8.57,69.85 | v35.24,66.74 39.12,66.74 IC10.2
  Bottom 0.305: v8.57,69.85 8.89,69.85 9.53,70.48 21.59,70.48 25.4,66.67 35.24,66.67 v35.24,66.74
FLAG_FW
  Top 0.305: IC4.13 IC4.2
  Bottom 0.305: IC4.8 3.49,14.61 4.13,13.97 14.29,13.97 IC4.13
FW_A6  (via drill 0.55)
  Top 0.305: v80.01,28.57 80.01,33.34 IC2.4
  Bottom 0.305: IC4.6 6.03,24.13 7.62,25.72 20.95,25.72 21.65,25.02 23.75,25.02 24.13,25.4 34.61,25.4 37.15,27.94 60.33,27.94 60.96,27.3 62.87,27.3 64.14,28.57 v80.01,28.57
GND  (via drill 0.8)  (1 unrouted)
  Top 0.813: C8.2 91.12,31.43 v91.12,38.73 91.12,44.77 91.76,45.4 91.76,48.26 C7.2 | C6.2 50.8,27.3 v54.61,31.11 54.61,33.34 IC2.14 50.48,37.47 C5.2 | C3.2 50.16,64.45 50.16,59.69 54.29,55.56 IC3.14 v54.29,48.26 | IC10.8 22.86,65.72 C1.2 26.35,58.1 IC9.8 | IC1.29 v72.07,66.67
  Bottom 0.813: LPT.10 LPT.12 LPT.14 LPT.16 LPT.18 LPT.20 | C3.2 48.58,67.31 71.44,67.31 v72.07,66.67 | APPLEIIBUS1.26 113.18,12.55 v111.44,14.29
  other vias: 93.66,17.14 73.34,31.75 14.92,32.38 1.91,23.5 42.86,71.12
  pour Top: 0,83.82 0,9.53 127,9.53 127,83.82
  pour Bottom: 0,83.19 0,9.53 127,9.53 127,83.19
LPT_!ACK  (via drill 0.55)
  Top 0.305: v13.65,34.29 13.65,31.11 14.92,29.84 v14.92,17.46 | v49.85,18.41 51.44,18.41 52.7,19.68 52.7,25.4 55.88,28.57 55.88,32.07 55.69,32.26 55.69,34.65 52.07,38.27 52.07,40.01 50.48,41.59 v50.48,42.23 | v100.33,52.39 100.33,59.05 101.6,60.33 104.78,60.33 111.12,53.98 LPT.19
  Bottom 0.305: IC7.11 11.11,39.69 12.38,38.42 12.38,35.24 13.34,34.29 v13.65,34.29 | v14.92,17.46 22.54,17.46 23.81,18.73 49.53,18.73 v49.85,18.41 | v50.48,42.23 53.66,45.4 74.77,45.4 75.41,46.04 87.95,46.04 89.53,47.62 90.49,47.62 92.08,46.04 | RN1.11 94.3,43.81 92.08,46.04 | 92.08,46.04 98.42,52.39 v100.33,52.39
LPT_!STROBE  (via drill 0.55)
  Top 0.305: v9.84,71.75 9.84,68.9 11.11,67.63 IC8.12 | v9.84,46.67 9.84,43.42 8.57,42.15 IC7.10
  Bottom 0.305: LPT.1 109.22,76.83 | 109.22,76.83 106.68,76.83 105.41,75.56 103.19,75.56 100.33,78.42 80.33,78.42 79.38,79.38 56.52,79.38 55.56,78.42 55.56,76.2 54.61,75.25 50.8,75.25 46.67,79.38 19.37,79.38 14.92,74.93 14.92,72.71 13.97,71.75 v9.84,71.75 | 109.22,76.83 109.22,69.85 106.68,67.31 106.68,54.93 101.28,49.53 97.79,49.53 96.52,48.26 96.52,45.09 RN1.10 | IC8.12 14.92,62.87 14.92,60.64 9.84,55.56 v9.84,46.67
LPT_D0
  Top 0.305: IC11.9 97.79,40.01 100.33,42.55 RN1.9
  Bottom 0.305: LPT.3 112.08,74.3 110.17,72.39 110.17,69.85 107.31,66.99 107.31,54.29 101.6,48.58 100.01,48.58 99.06,47.62 99.06,45.09 RN1.9
LPT_D1
  Top 0.305: IC11.6 105.41,40.01 102.87,42.55 RN1.8
  Bottom 0.305: LPT.5 107.95,66.67 107.95,53.66 101.6,47.31 101.6,45.09 RN1.8
LPT_D2
  Top 0.305: IC11.5 107.95,40.01 105.41,42.55 RN1.7
  Bottom 0.305: LPT.7 108.58,64.77 108.58,52.39 104.14,47.94 104.14,45.09 RN1.7
LPT_D3
  Bottom 0.305: LPT.9 109.22,62.87 109.22,50.8 106.68,48.26 106.68,45.09 RN1.6 110.49,41.27 114.3,41.27 115.57,40.01 IC11.2
LPT_D4
  Bottom 0.305: LPT.11 109.86,60.96 109.86,49.13 109.22,48.49 109.22,45.09 RN1.5 110.49,43.18 111.76,41.91 115.57,41.91 116.84,40.64 116.84,35.56 115.57,34.29 IC11.19
LPT_D5
  Bottom 0.305: LPT.13 110.49,59.05 110.49,49.21 112.01,47.69 112.01,45.93 113.03,44.92 RN1.4 113.03,43.65 113.88,42.8 115.63,42.8 119.7,38.73 119.7,30.8 118.75,29.84 106.68,29.84 IC11.15
LPT_D6  (via drill 0.55)
  Top 0.305: v107.95,28.57 IC11.16
  Bottom 0.305: LPT.15 111.12,57.15 111.12,50.8 114.3,47.62 114.3,45.09 RN1.3 120.33,39.05 120.33,30.16 118.75,28.57 v107.95,28.57
LPT_D7
  Bottom 0.305: LPT.17 111.76,55.24 111.76,52.39 116.59,47.56 116.59,45.34 RN1.2 120.9,41.02 120.9,29.46 118.75,27.3 99.06,27.3 97.79,28.57 IC11.12
LPT_LATCH  (via drill 0.55)
  Top 0.305: IC11.11 95.25,36.51 93.98,37.78 93.98,49.21 96.2,51.44 v96.2,79.38
  Bottom 0.305: v96.2,79.38 93.82,81.76 3.33,81.76 1.27,79.69 1.27,30.8 IC5.8
MEM_A0  (via drill 0.55)
  Top 0.305: IC14.14 36.51,26.04 35.5,27.05 35.5,33.91 36.51,34.92 IC13.14 36.51,39.37 33.97,41.91 v33.97,44.45
  Bottom 0.305: IC9.9 26.67,46.35 27.94,45.09 33.34,45.09 v33.97,44.45
MEM_A1
  Top 0.305: IC14.13 39.05,26.04 38.04,27.05 38.04,33.91 39.05,34.92 IC13.13 39.05,40.87 34.67,45.26 34.67,45.66 IC9.12
MEM_A2
  Top 0.305: IC9.4 36.51,52.39 40.32,48.58 40.32,44.77 41.59,43.5 IC13.12 41.59,34.92 40.32,33.66 40.32,27.3 41.59,26.04 IC14.12
MEM_A3  (via drill 0.55)
  Top 0.305: IC14.11 44.13,26.04 42.86,27.3 42.86,33.66 44.13,34.92 IC13.11 44.13,43.5 45.4,44.77 45.4,57.78 v45.09,58.1
  Bottom 0.305: v45.09,58.1 43.5,59.69 35.88,59.69 IC10.12
MEM_A4  (via drill 0.55)
  Top 0.305: IC14.8 44.13,19.37 45.5,20.73 45.5,25.94 44.13,27.3 IC13.8 44.13,33.66 45.4,34.92 45.4,43.5 46.04,44.13 46.04,58.42 45.72,58.74 v45.72,66.67
  Bottom 0.305: v45.72,66.67 37.78,66.67 36.83,67.63 30.48,67.63 IC10.7
MEM_A5  (via drill 0.55)
  Top 0.305: IC14.7 41.59,19.37 42.86,20.64 42.86,26.04 41.59,27.3 IC13.7 41.59,33.66 42.86,34.92 v42.86,51.12 | v39.37,51.12 39.05,51.12 37.78,52.39 37.78,57.47 v36.51,58.74
  Bottom 0.305: v42.86,51.12 v39.37,51.12 | v36.51,58.74 29.21,58.74 IC10.9
MEM_A6
  Top 0.305: IC14.6 39.05,19.37 40.32,20.64 40.32,26.04 39.05,27.3 IC13.6 39.05,33.66 40.32,34.92 40.32,40.64 35.18,45.78 35.18,48.64 32.07,51.75 31.11,51.75 IC9.7
MEM_A7  (via drill 0.55)
  Top 0.305: v46.04,68.58 46.61,68.01 46.61,59.12 49.53,56.2 49.53,50.48 46.67,47.62 IC13.10 46.67,34.92 45.4,33.66 45.4,27.39 46.67,26.12 IC14.10
  Bottom 0.305: v46.04,68.58 45.4,67.94 37.78,67.94 IC10.4
N$1  (via drill 0.55)
  Top 0.305: IC1.16 v61.91,73.03 61.91,67.94 59.37,65.41 IC1.24
  Bottom 0.305: IC1.17 IC1.16 | IC1.25 IC1.24 | v61.91,73.03 73.03,73.03 74.61,71.44 102.23,71.44 103.19,70.48 R5.1
N$2  (via drill 0.55)
  Top 0.305: v6.03,43.18 v6.03,46.99
  Bottom 0.305: IC7.8 5.4,43.18 v6.03,43.18 | v6.03,46.99 7.62,45.4 10.48,45.4 12.73,47.66 21.3,47.66 R2.1
N$3
  Top 0.305: T1.1 R3.2 22.54,35.88 21.27,34.61 21.27,32.07 22.23,31.11 R4.1
N$4
  Top 0.305: R1.2 30.16,76.2 30.8,76.83 43.5,76.83 44.13,76.2 IC10.1 44.13,68.26 42.93,67.06 42.93,57.72 44.13,56.52 IC9.1
N$5  (via drill 0.55)
  Top 0.305: IC8.11 8.57,64.14 7.3,62.87 v7.3,38.1
  Bottom 0.305: v7.3,38.1 9.21,38.1 IC5.4
N$6
  Bottom 0.305: IC4.4 IC4.3
N$8  (via drill 0.55)
  Top 0.305: IC8.5 11.11,69.85 v11.75,69.22 | v18.73,69.53 IC8.15
  Bottom 0.305: v18.73,69.53 12.06,69.53 v11.75,69.22
N$10
  Top 0.305: IC11.1 116.84,40.01 110.17,40.01 109.22,39.05 109.22,36.83 106.68,34.29 106.68,16.83 107.95,15.56 JMP1.2 109.54,14.29
N$11  (via drill 0.55)
  Top 0.305: v13.49,44.93 13.49,43.66 12.38,42.55 12.38,33.34 9.84,30.8 9.84,19.37 11.11,18.1 IC4.11
  Bottom 0.305: IC4.10 IC4.11 | T1.2 24.45,43.81 14.61,43.81 v13.49,44.93
N$14  (via drill 0.55)
  Top 0.305: v110.17,10.16 110.64,9.69 APPLEIIBUS1.24
  Bottom 0.305: APPLEIIBUS1.24 110.64,9.69 v110.17,10.16
N$15
  Top 0.305: IC4.12 13.65,18.1 12.38,19.37 12.38,26.67 11.11,27.94 IC5.11
N$18
  Bottom 0.305: IC5.6 6.03,38.42 7.3,39.69 7.3,44.13 6.35,45.09 5.4,45.09 4.76,45.72 4.76,58.74 6.03,60.01 12.06,60.01 IC6.3
N$19
  Bottom 0.305: IC8.10 6.03,65.41 5.4,64.77 3.17,64.77 2.48,64.07 2.48,32.45 4.13,30.8 11.43,30.8 IC5.12
PHASE0  (via drill 0.55, 0.55 pad 0.55)
  Top 0.305: v78.11,10.16 79.06,10.16 83.5,14.61 83.5,34.61 83.19,34.92 66.36,34.92 65.72,34.29 65.72,31.43 63.98,29.69 v62.23,29.69
  Bottom 0.305: APPLEIIBUS1.40 77.62,9.68 v78.11,10.16 | v62.23,29.69 61.75,29.21 35.95,29.21 33.73,26.99 26.35,26.99 23.75,29.59 17.21,29.59 IC5.13
Q3  (via drill 0.55)
  Top 0.305: v85.41,10.16 88.58,13.34 88.58,67.63 80.96,75.25 v80.96,79.38 | v12.38,76.83 12.38,69.85 12.7,69.53 12.7,68.26 12.38,67.94 12.38,65.41 9.84,62.87 9.84,52.7 IC7.3 13.65,46.04 14.92,44.77 14.92,39.37 16.19,38.1 IC5.2
  Bottom 0.305: APPLEIIBUS1.37 85.24,10 v85.41,10.16 | v80.96,79.38 80.96,79.46 79.43,80.99 16.54,80.99 v12.38,76.83
ROM!CE  (via drill 0.55)
  Top 0.305: IC3.20 65.41,37.15 64.14,37.15 61.66,34.67 57.4,34.67 55.56,36.51 v55.56,40.64 | v11.43,44.13 11.43,43.81 9.84,42.23 9.84,33.66 8.57,32.38 IC5.10
  Bottom 0.305: IC5.10 6.99,30.16 3.49,30.16 1.91,31.75 1.91,72.07 2.86,73.03 12.38,73.03 IC8.4 | v55.56,40.64 54.93,40.64 53.66,41.91 52.7,41.91 51.12,40.32 39.69,40.32 36.51,43.5 35.24,43.5 34.61,42.86 33.02,42.86 31.43,44.45 25.72,44.45 23.18,46.99 13.65,46.99 11.43,44.77 v11.43,44.13
VCC  (via drill 0.8)
  Top 0.813: APPLEIIBUS1.25 113.18,10.96 | 106.05,11.91 112.24,11.91 113.18,10.96 | 106.05,11.91 R7.2 93.5,15.56 92.08,15.56 91.44,16.19 v91.44,18.41 C8.1 | JMP1.1 106.25,12.11 106.05,11.91 | 113.18,10.96 114.29,12.06 115.89,12.06 118.11,14.29 IC12.20 C11.1 124.46,18.41 125.73,19.68 125.73,29.84 C10.1 | C10.1 125.73,37.47 125.73,39.37 121.28,43.81 RN1.1 120.65,50.8 119.06,52.39 109.54,52.39 R6.2 | v102.87,61.59 103.82,62.55 C9.1 | IC2.1 IC3.28 87.31,43.18 86.36,44.13 v86.36,47.62 86.36,53.02 IC3.1 | IC14.9 46.67,20 49.21,22.54 v49.21,23.81 49.21,26.99 46.67,29.53 IC13.9 49.21,33.66 | 49.21,33.66 C5.1 | 49.21,33.66 48.26,34.61 v48.26,44.13 C4.1 50.8,48.9 50.8,56.52 47.94,59.37 C3.1 | IC8.16 21.27,56.52 | 21.27,56.52 21.27,53.98 | 21.27,53.98 IC6.14 | C1.1 21.27,56.52 | 21.27,53.98 21.27,48.9 | 21.27,48.9 21.27,46.99 | 21.27,46.99 T1.3 | IC7.1 21.27,48.9 | 21.27,46.99 20.32,46.99 18.73,45.4 IC7.14 20.32,39.69 20.32,33.97 18.73,32.38 IC5.14 20.64,26.67 20.64,22.23 18.73,20.32 IC4.14 | v74.61,73.03 IC1.11 | C10.1 119.38,31.11 IC11.20 | R8.2 R9.2 R10.2 R11.2 R12.2 R13.2 R14.2 R15.2 R16.2 R17.2
  Bottom 0.813: v102.87,61.59 R6.2 99.69,55.88 92.71,55.88 91.44,54.61 C7.1 91.12,53.98 IC3.1 | R5.2 107.63,75.56 C9.1 102.55,73.03 v74.61,73.03 | C6.1 IC14.9 45.09,17.46 24.45,17.46 C2.1 IC4.14 | v91.44,18.41 IC2.28 IC2.27 IC2.25 IC2.24 IC2.23 73.03,16.83 71.12,16.83 IC2.21 | C4.1 IC9.16 | C3.1 IC10.16 | IC3.28 IC3.27 82.23,38.73 | IC2.1 IC2.2 | v86.36,47.62 69.53,47.62 68.26,46.35 52.39,46.35 50.16,44.13 v48.26,44.13 | R17.2 RN1.1 | IC6.4 11.11,63.82 9.84,65.09 9.84,67.94 9.97,68.08 11.3,68.08 11.43,67.94 20,67.94 IC8.16
Z80_A0
  Bottom 0.305: IC9.10 30.61,48.07 49.74,48.07 53.27,51.59 62.07,51.59 IC3.10 66.99,56.52 69.69,56.52 74.61,61.44 IC1.30
Z80_A1  (via drill 0.55)
  Top 0.305: v64.77,56.52 66.99,54.29 IC3.9
  Bottom 0.305: IC1.31 75.25,59.69 73.98,59.69 69.85,55.56 68.58,55.56 IC3.9 | IC9.6 32.7,52.7 46.04,52.7 49.21,55.88 64.14,55.88 v64.77,56.52
Z80_A2
  Bottom 0.305: IC1.32 77.15,59.05 74.61,59.05 IC3.8 66.36,50.8 53.68,50.8 50.23,47.36 50.23,46.42 48.95,45.14 47.84,45.14 47.78,45.09 37.15,45.09 36.51,45.72 IC9.13
Z80_A3
  Bottom 0.305: IC3.7 76.52,58.42 79.06,58.42 IC1.33 80.96,62.87 73.98,62.87 73.3,62.19 73.3,61 70.85,58.55 49.97,58.55 46.67,55.24 40.01,55.24 39.05,54.29 IC9.3
Z80_A4  (via drill 0.55)
  Top 0.305: IC10.10 28.89,59.05 32.7,55.24 32.7,52.7 37.78,47.62 37.78,45.09 39.37,43.5 v40.01,43.5 | v76.2,45.09 76.2,47.62 74.61,49.21 IC3.6
  Bottom 0.305: IC1.34 80.96,57.78 78.42,57.78 IC3.6 | v40.01,43.5 46.99,43.5 49.15,41.34 51.19,41.34 54.42,44.58 75.62,44.58 76.12,45.09 v76.2,45.09
Z80_A5  (via drill 0.55)
  Top 0.305: IC10.6 v31.43,75.56 | IC3.5 77.15,57.15 75.88,58.42 75.88,62.87 77.47,64.45 77.47,66.36 v74.3,69.53
  Bottom 0.305: IC1.35 82.87,57.15 80.33,57.15 IC3.5 | v31.43,75.56 45.09,75.56 51.12,69.53 v74.3,69.53
Z80_A6  (via drill 0.55)
  Top 0.305: v68.26,60.01 v68.26,51.44
  Bottom 0.305: IC1.36 84.77,56.52 82.23,56.52 IC3.4 79.54,53.98 78.53,52.96 70.74,52.96 69.22,51.44 v68.26,51.44 | IC10.13 37.78,60.33 48.58,60.33 50.86,62.61 67.88,62.61 68.26,62.23 v68.26,60.01
Z80_A7
  Bottom 0.305: IC3.3 84.14,55.88 86.68,55.88 IC1.37 90.49,63.5 70.8,63.5 70.17,62.87 69.53,62.87 69.12,63.28 50.26,63.28 49.59,62.61 40.07,62.61 IC10.14
Z80_A8  (via drill 0.55)
  Top 0.305: IC10.3 v39.05,73.98 | IC3.25 79.69,41.27 80.96,42.55 v80.96,64.77 v80.96,69.53
  Bottom 0.305: v80.96,69.53 76.2,69.53 74.93,68.26 73.66,68.26 73.06,68.87 50.75,68.87 45.64,73.98 v39.05,73.98 | v80.96,64.77 81.28,64.45 92.08,64.45 IC1.38
Z80_A9  (via drill 0.55)
  Top 0.305: IC10.5 v33.97,73.03 | IC3.24 77.15,41.59 78.42,42.86 78.42,63.82 v79.38,64.77 79.38,66.67 v77.47,68.58
  Bottom 0.305: v79.38,64.77 80.33,65.72 81.92,65.72 82.55,65.09 93.98,65.09 IC1.39 | v77.47,68.58 76.52,68.58 75.56,67.63 73.34,67.63 72.77,68.2 50.38,68.2 45.55,73.03 v33.97,73.03
Z80_A10  (via drill 0.55)
  Top 0.305: v69.85,64.14 66.99,64.14 65.72,62.87 65.72,59.37 63.18,56.83 63.18,48.9 69.53,42.55 IC3.21
  Bottom 0.305: IC1.40 95.89,65.72 83.5,65.72 82.87,66.36 79.06,66.36 76.83,64.14 v69.85,64.14 49.93,64.14 49.42,63.63 32.83,63.63 31.43,62.23 IC10.11
Z80_A11  (via drill 0.55)
  Top 0.305: IC1.1 v100.01,66.36 | v37.78,65.09 37.78,60.01 41.59,56.2 IC9.2 | v76.2,65.41 73.34,62.55 73.34,43.81 74.61,42.55 IC3.23
  Bottom 0.305: v100.01,66.36 84.14,66.36 83.5,66.99 77.79,66.99 v76.2,65.41 75.88,65.09 70.48,65.09 70.17,65.41 49.85,65.41 48.9,64.45 44.13,64.45 43.5,65.09 v37.78,65.09 37.15,64.45 19.05,64.45 IC6.2
Z80_A12  (via drill 0.55)
  Top 0.305: IC1.2 v97.47,67.94 | v86.36,67.94 86.36,63.82 86.04,63.5 86.04,58.42 84.77,57.15 IC3.2 | v28.89,65.41 31.43,65.41 32.7,64.14 32.7,59.37 35.24,56.83 35.24,52.07 39.05,48.26 IC9.14
  Bottom 0.305: IC8.13 14.92,65.41 v28.89,65.41 35.88,65.41 36.51,66.04 44.13,66.04 44.77,65.41 48.58,65.41 49.53,66.36 70.96,66.36 71.72,65.6 75.14,65.6 77.2,67.66 78.14,67.66 78.42,67.94 v86.36,67.94 v97.47,67.94
Z80_A13  (via drill 0.55)
  Top 0.305: v16.19,71.75 IC8.14 16.19,64.14 14.92,62.87 14.92,57.78 v16.19,56.52
  Bottom 0.305: IC1.3 94.93,75.56 93.4,74.03 56.89,74.03 56.2,73.34 48.9,73.34 45.72,76.52 29.84,76.52 28.57,75.25 24.77,75.25 22.54,73.03 17.46,73.03 v16.19,71.75 | v16.19,56.52 17.46,57.78 24.77,57.78 25.72,56.83 33.02,56.83 33.97,55.88 IC9.5
Z80_A14  (via drill 0.55)
  Top 0.305: v27.62,76.77 27.62,52.7 28.26,52.07 29.53,52.07 30.48,51.12 30.48,49.21 31.43,48.26 IC9.11
  Bottom 0.305: IC1.4 92.39,75.88 91.05,74.54 56.36,74.54 55.77,73.95 49.56,73.95 46.04,77.47 27.62,77.47 | 27.62,77.47 21.91,77.47 IC8.2 | 27.62,77.47 v27.62,76.77
Z80_A15  (via drill 0.55)
  Top 0.305: IC8.3 17.46,73.03 v17.46,52.07
  Bottom 0.305: IC1.5 88.27,75.25 55.88,75.25 55.24,74.61 50.16,74.61 46.35,78.42 20.32,78.42 IC8.3 | v17.46,52.07 14.29,52.07 IC7.4
Z80_D0  (via drill 0.55)
  Top 0.305: IC1.14 66.99,69.53 63.44,65.98 63.44,58.36 61.91,56.83 IC3.11 61.91,41.91 v62.55,41.27 | IC11.8 99.06,37.47 99.06,29.21 97.79,27.94 IC12.9 | IC13.17 28.89,43.18 27.62,44.45 27.62,47.62 v28.57,48.58
  Bottom 0.305: v62.55,41.27 77.79,41.27 78.99,42.48 89.6,42.48 92.08,40.01 99.06,40.01 IC11.8 | v28.57,48.58 28.89,48.9 49.21,48.9 52.55,52.23 60.17,52.23 IC3.11
Z80_D1  (via drill 0.55)
  Top 0.305: IC1.15 64.45,68.9 60.9,65.34 60.9,58.04 59.37,56.52 IC3.12 60.01,53.34 v60.01,41.59 | IC11.7 103.5,38.73 105.09,37.15 105.09,35.24 104.14,34.29 104.14,29.21 105.41,27.94 IC12.6 | IC13.15 33.97,40.64 32.7,41.91 32.7,49.53 v32.07,50.16
  Bottom 0.305: v60.01,41.59 60.64,42.23 77.47,42.23 78.42,43.18 90.17,43.18 92.39,40.96 100.65,40.96 IC11.7 | v32.07,50.16 49.21,50.16 52.01,52.96 58.36,52.96 IC3.12
Z80_D2  (via drill 0.55)
  Top 0.305: IC1.12 69.22,79.69 59.69,79.69 58.1,78.11 58.1,68.26 55.56,65.72 55.56,60.01 56.83,58.74 IC3.13 56.83,48.9 57.78,47.94 v57.78,42.23 | IC13.3 31.43,34.61 32.7,35.88 32.7,40.56 31.72,41.54 31.72,43.85 30.16,45.4 30.16,48.26 29.21,49.21 v29.21,50.8 | IC12.5 109.22,27.3 109.22,35.56 110.49,36.83 IC11.4
  Bottom 0.305: v57.78,42.23 58.42,42.86 76.83,42.86 77.79,43.81 90.81,43.81 93.03,41.59 107.63,41.59 IC11.4 | v29.21,50.8 30.16,51.75 30.18,51.75 30.43,52 46.6,52 49.59,54.99 55.82,54.99 IC3.13
Z80_D3  (via drill 0.55)
  Top 0.305: IC11.3 113.03,35.56 114.3,34.29 114.3,28.57 115.57,27.3 IC12.2 | v90.17,46.35 90.17,49.53 93.03,52.39 93.03,57.47 91.12,59.37 91.12,67.94 IC1.8 | v55.24,42.55 54.29,41.59 IC3.15 | IC13.2 29.37,31.59 29.37,35.72 v28.89,36.2
  Bottom 0.305: IC11.3 111.44,40.32 110.17,40.32 107.95,42.55 93.66,42.55 90.17,46.04 v90.17,46.35 88.27,44.45 77.15,44.45 76.52,43.81 56.52,43.81 v55.24,42.55 | v28.89,36.2 29.53,36.2 29.84,36.51 52.07,36.51 IC3.15
Z80_D4  (via drill 0.55)
  Top 0.305: IC14.17 28.89,25.72 27.62,26.99 27.62,33.02 v28.26,33.66 | IC12.19 114.3,19.68 114.3,27.3 113.03,28.57 IC11.18 | IC1.7 93.66,67.94 93.66,59.37 94.3,58.74 94.3,51.75 92.71,50.16 v92.71,33.66
  Bottom 0.305: v28.26,33.66 30.48,35.88 52.39,35.88 53.02,36.51 54.5,36.51 56.73,38.73 IC3.16 58.49,37.08 60.37,37.08 62.53,34.92 91.44,34.92 v92.71,33.66 93.66,33.66 94.93,32.38 111.76,32.38 IC11.18
Z80_D5  (via drill 0.55)
  Top 0.305: IC14.15 33.97,26.04 32.7,27.3 32.7,34.29 v33.02,34.61 | v57.15,36.83 59.05,38.73 IC3.17 | R7.1 86.04,13.49 86.04,40.32 v84.77,41.59 83.5,42.86 83.5,71.12 79.69,74.93 IC1.9 | v104.14,36.2 102.87,34.92 IC11.14 102.87,28.89 104.14,27.62 104.14,19.68 IC12.15
  Bottom 0.305: APPLEIIBUS1.28 108.1,10.01 107,11.11 100.65,11.11 98.42,13.34 85.88,13.34 R7.1 | v33.02,34.61 33.66,35.24 53.02,35.24 53.66,35.88 56.2,35.88 v57.15,36.83 | v104.14,36.2 103.19,37.15 90.81,37.15 86.36,41.59 v84.77,41.59 79.38,41.59 78.42,40.64 63.82,40.64 63.18,40.01 60.64,40.01 IC3.17
Z80_D6  (via drill 0.55)
  Top 0.305: IC14.2 28.89,19.37 30.16,20.64 30.16,26.04 29.21,26.99 v29.21,29.21 | v58.74,36.2 59.37,36.2 IC3.18 60.64,40.01 57.78,40.01 56.52,41.27 56.52,47.94 55.56,48.9 55.56,57.78 53.02,60.33 53.02,67.63 55.56,70.17 55.56,77.47 58.42,80.33 73.66,80.33 IC1.10 | v26.35,33.66 27.62,34.92 27.62,42.86 24.77,45.72 24.77,46.67 v26.35,48.26 | v111.76,34.92 111.76,33.34 110.49,32.07 IC11.17 110.49,28.57 111.51,27.56 111.51,21.97 IC12.16
  Bottom 0.305: v58.74,36.2 57.47,34.92 53.66,34.92 50.48,31.75 49.53,31.75 47.94,33.34 31.11,33.34 30.16,32.38 30.16,30.16 v29.21,29.21 28.57,29.21 27.62,30.16 27.62,32.38 v26.35,33.66 | v26.35,48.26 26.35,50.8 R2.2 | v111.76,34.92 109.86,33.02 95.25,33.02 92.71,35.56 65.09,35.56 IC3.18
Z80_D7  (via drill 0.55)
  Top 0.305: v31.75,29.21 31.75,26.99 32.7,26.04 32.7,20.64 31.43,19.37 IC14.3 29.84,14.29 25.72,14.29 24.77,15.24 24.77,21.91 22.54,24.13 R4.2 | v60.64,35.56 61.28,35.56 IC3.19 63.35,38.73 61.57,40.51 59.5,40.51 58.74,41.27 58.74,48.58 58.1,49.21 58.1,65.64 60.39,67.92 60.39,77.53 61.72,78.87 67.5,78.87 IC1.13 | v101.28,35.88 100.33,34.92 IC11.13 100.33,29.21 99.06,27.94 99.06,22.86 97.79,21.59 IC12.12
  Bottom 0.305: v31.75,29.21 32.7,30.16 32.7,32.38 33.02,32.7 47.62,32.7 49.21,31.11 52.7,31.11 53.82,32.23 60.17,32.23 60.64,32.7 v60.64,35.56 | IC3.19 64.45,37.47 65.72,36.2 100.97,36.2 v101.28,35.88